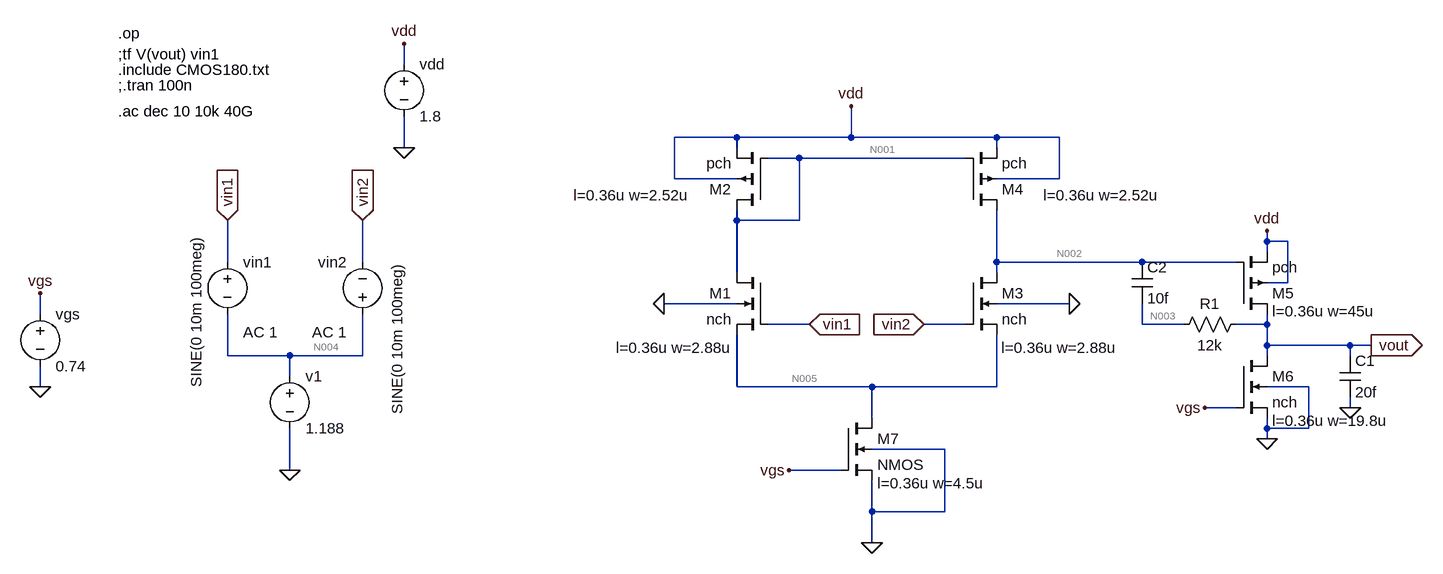
[diagram p0: schematic two STAGE OPAMP new - Copy.asc]
two STAGE OPAMP new - Copy.asc, the LTspice schematic file:
Version 4
SHEET 1 1008 680
WIRE -592 -96 -592 -128
WIRE -80 16 -176 16
WIRE 96 16 96 -32
WIRE 96 16 -80 16
WIRE 320 16 96 16
WIRE 416 16 320 16
WIRE -592 32 -592 -16
WIRE -80 32 -80 16
WIRE 320 32 320 16
WIRE 16 48 -32 48
WIRE 272 48 16 48
WIRE -176 80 -176 16
WIRE -80 80 -176 80
WIRE 416 80 416 16
WIRE 416 80 320 80
WIRE -80 144 -80 128
WIRE 16 144 16 48
WIRE 16 144 -80 144
WIRE 736 176 736 160
WIRE 768 176 736 176
WIRE 736 192 736 176
WIRE -864 208 -864 144
WIRE -656 208 -656 144
WIRE 320 208 320 128
WIRE 544 208 320 208
WIRE 688 208 544 208
WIRE -80 224 -80 144
WIRE 320 224 320 208
WIRE 768 240 768 176
WIRE 768 240 736 240
WIRE -80 272 -192 272
WIRE 432 272 320 272
WIRE -1152 288 -1152 256
WIRE 32 304 -32 304
WIRE 272 304 208 304
WIRE 544 304 544 272
WIRE 608 304 544 304
WIRE 736 304 736 288
WIRE 736 304 688 304
WIRE 736 336 736 304
WIRE 864 336 736 336
WIRE 896 336 864 336
WIRE -864 352 -864 288
WIRE -768 352 -864 352
WIRE -656 352 -656 288
WIRE -656 352 -768 352
WIRE 736 352 736 336
WIRE 864 352 864 336
WIRE -768 384 -768 352
WIRE -1152 400 -1152 368
WIRE -80 400 -80 320
WIRE 128 400 -80 400
WIRE 320 400 320 320
WIRE 320 400 128 400
WIRE 800 400 736 400
WIRE 688 432 640 432
WIRE 864 432 864 416
WIRE 128 448 128 400
WIRE 736 464 736 448
WIRE 800 464 800 400
WIRE 800 464 736 464
WIRE 736 480 736 464
WIRE 240 496 128 496
WIRE -768 528 -768 464
WIRE 80 528 0 528
WIRE 128 592 128 544
WIRE 240 592 240 496
WIRE 240 592 128 592
WIRE 128 640 128 592
FLAG 96 -32 vdd
FLAG -768 528 0
FLAG -864 144 vin1
IOPIN -864 144 In
FLAG -656 144 vin2
IOPIN -656 144 In
FLAG 32 304 vin1
IOPIN 32 304 In
FLAG 208 304 vin2
IOPIN 208 304 In
FLAG -592 -128 vdd
FLAG -592 32 0
FLAG -192 272 0
FLAG 432 272 0
FLAG 736 160 vdd
FLAG 896 336 vout
IOPIN 896 336 Out
FLAG 736 480 0
FLAG 640 432 vgs
FLAG 864 432 0
FLAG -1152 400 0
FLAG -1152 256 vgs
FLAG 128 640 0
FLAG 0 528 vgs
DATAFLAG 320 160 ""
DATAFLAG 320 160 ""
DATAFLAG -80 144 ""
DATAFLAG -80 144 ""
DATAFLAG 128 400 ""
SYMBOL nmos4 -32 224 M0
WINDOW 123 55 116 Left 2
SYMATTR Value2 l=0.36u w=2.88u
SYMATTR InstName M1
SYMATTR Value nch
SYMBOL pmos4 -32 128 R180
WINDOW 123 120 23 Left 2
SYMATTR Value2 l=0.36u w=2.52u
SYMATTR InstName M2
SYMATTR Value pch
SYMBOL nmos4 272 224 R0
WINDOW 123 55 116 Left 2
SYMATTR Value2 l=0.36u w=2.88u
SYMATTR InstName M3
SYMATTR Value nch
SYMBOL pmos4 272 128 M180
WINDOW 123 120 23 Left 2
SYMATTR Value2 l=0.36u w=2.52u
SYMATTR InstName M4
SYMATTR Value pch
SYMBOL voltage -768 368 R0
WINDOW 123 0 0 Left 0
WINDOW 39 0 0 Left 0
SYMATTR InstName v1
SYMATTR Value 1.188
SYMBOL voltage -864 192 R0
WINDOW 3 -48 -25 VRight 2
WINDOW 123 24 124 Left 2
WINDOW 39 0 0 Left 0
SYMATTR Value SINE(0 10m 100meg)
SYMATTR Value2 AC 1
SYMATTR InstName vin1
SYMBOL voltage -656 304 R180
WINDOW 0 24 96 Left 2
WINDOW 3 -53 -138 VRight 2
WINDOW 123 24 -12 Left 2
WINDOW 39 0 0 Left 0
SYMATTR InstName vin2
SYMATTR Value SINE(0 10m 100meg)
SYMATTR Value2 AC 1
SYMBOL voltage -592 -112 R0
WINDOW 123 0 0 Left 0
WINDOW 39 0 0 Left 0
SYMATTR InstName vdd
SYMATTR Value 1.8
SYMBOL pmos4 688 288 M180
WINDOW 123 56 4 Left 2
SYMATTR Value2 l=0.36u w=45u
SYMATTR InstName M5
SYMATTR Value pch
SYMBOL nmos4 688 352 R0
WINDOW 123 56 100 Left 2
SYMATTR Value2 l=0.36u w=19.8u
SYMATTR InstName M6
SYMATTR Value nch
SYMBOL cap 848 352 R0
SYMATTR InstName C1
SYMATTR Value 20f
SYMBOL voltage -1152 272 R0
WINDOW 123 0 0 Left 0
WINDOW 39 0 0 Left 0
SYMATTR InstName vgs
SYMATTR Value 0.74
SYMBOL cap 528 208 R0
SYMATTR InstName C2
SYMATTR Value 10f
SYMBOL res 704 288 R90
WINDOW 0 0 56 VBottom 2
WINDOW 3 32 56 VTop 2
SYMATTR InstName R1
SYMATTR Value 12k
SYMBOL nmos4 80 448 R0
WINDOW 123 56 100 Left 2
SYMATTR Value2 l=0.36u w=4.5u
SYMATTR InstName M7
TEXT -1032 -88 Left 2 !.include CMOS180.txt
TEXT -1032 -144 Left 2 !.op
TEXT -1032 -112 Left 2 !;tf V(vout) vin1
TEXT -1032 -64 Left 2 !;.tran 100n
TEXT -1032 -24 Left 2 !.ac dec 10 10k 40G

The netlist it stands for:
* two STAGE OPAMP new - Copy.asc
M1 N001 vin1 N005 0 nch l=0.36u w=2.88u
M2 N001 N001 vdd vdd pch l=0.36u w=2.52u
M3 N002 vin2 N005 0 nch l=0.36u w=2.88u
M4 N002 N001 vdd vdd pch l=0.36u w=2.52u
v1 N004 0 1.188
vin1 vin1 N004 SINE(0 10m 100meg) AC 1
vin2 N004 vin2 SINE(0 10m 100meg) AC 1
vdd vdd 0 1.8
M5 vout N002 vdd vdd pch l=0.36u w=45u
M6 vout vgs 0 0 nch l=0.36u w=19.8u
C1 vout 0 20f
vgs vgs 0 0.74
C2 N002 N003 10f
R1 vout N003 12k
M7 N005 vgs 0 0 NMOS l=0.36u w=4.5u
.model NMOS NMOS
.model PMOS PMOS
.lib standard.mos
.include CMOS180.txt
.op
;tf V(vout) vin1
;.tran 100n
.ac dec 10 10k 40G
.backanno
.end

* Results of the author's LTspice run, read from the files saved beside the schematic
* Operating Point, zero values left out:
*   V(n001) = 1.01 V
*   V(vin1) = 1.188 V
*   V(n005) = 446.5 mV
*   V(vdd) = 1.8 V
*   V(n002) = 1.01 V
*   V(vin2) = 1.188 V
*   V(n004) = 1.188 V
*   V(vout) = 896.2 mV
*   V(vgs) = 740 mV
*   V(n003) = 896.2 mV
*   Id(M5) = -527.8 µA
*   Is(M5) = 527.8 µA
*   Id(M4) = -28.84 µA
*   Is(M4) = 28.84 µA
*   Id(M2) = -28.84 µA
*   Is(M2) = 28.84 µA
*   Id(M6) = 527.8 µA
*   Is(M6) = -527.8 µA
*   Id(M3) = 28.84 µA
*   Ib(M3) = -1.476 pA
*   Is(M3) = -28.84 µA
*   Id(M1) = 28.84 µA
*   Ib(M1) = -1.476 pA
*   Is(M1) = -28.84 µA
*   Id(M7) = 57.68 µA
*   Is(M7) = -57.68 µA
*   I(Vdd) = -585.5 µA
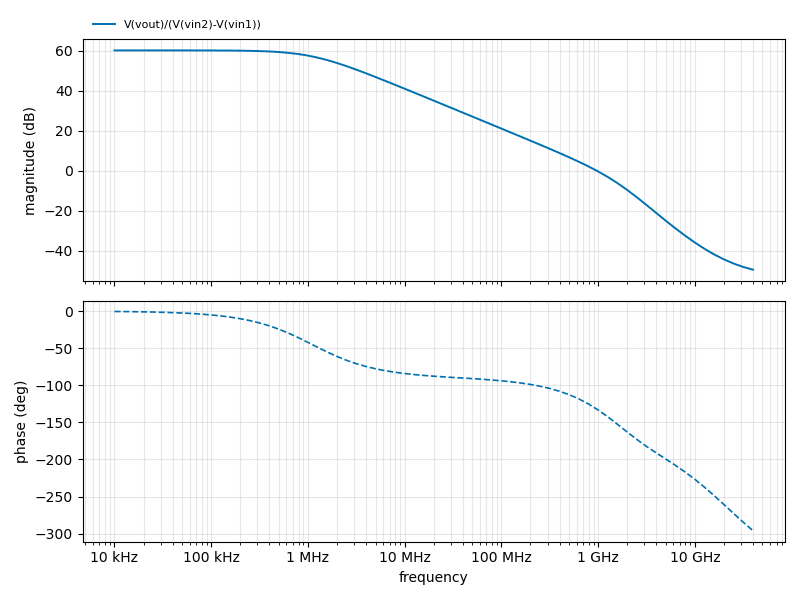
[diagram p1: AC Analysis of two STAGE OPAMP new - Copy.asc, plotted from the saved traces]
* AC Analysis, 1 run:
*   V(vout)/(V(vin2)-V(vin1)): 60.26 dB at 10 kHz, -49.56 dB at 40 GHz, peak 60.26 dB at 10 kHz, 3 dB below the peak at 1.098 MHz
* From the log:
*   Semiconductor Device Operating Points:
*                           --- MOSFET Transistors ---
*   Name:          m7
*   Model:        nmos
*   Id:          5.77e-05
*   Vgs:         7.40e-01
*   Vds:         4.46e-01
*   Vbs:         0.00e+00
*   Vth:         0.00e+00
*   Vdsat:       7.40e-01
*   Gm:          1.12e-04
*   Gds:         7.34e-05
*   Gmb:         0.00e+00
*   Cbd:         0.00e+00
*   Cbs:         0.00e+00
*   Cgsov:       0.00e+00
*   Cgdov:       0.00e+00
*   Cgbov:       0.00e+00
*   Cgs:         0.00e+00
*   Cgd:         0.00e+00
*   Cgb:         0.00e+00
*                           --- BSIM3 MOSFETS ---
*   Name:        m5          m4          m2          m6          m3
*   Model:       pch         pch         pch         nch         nch
*   Id:       -5.28e-04   -2.88e-05   -2.88e-05    5.28e-04    2.88e-05
*   Vgs:      -7.90e-01   -7.90e-01   -7.90e-01    7.40e-01    7.42e-01
*   Vds:      -9.04e-01   -7.90e-01   -7.90e-01    8.96e-01    5.63e-01
*   Vbs:       0.00e+00    0.00e+00    0.00e+00    0.00e+00   -4.46e-01
*   Vth:      -4.49e-01   -4.48e-01   -4.48e-01    4.59e-01    5.82e-01
*   Vdsat:    -2.83e-01   -2.76e-01   -2.76e-01    2.05e-01    1.40e-01
*   Gm:        2.77e-03    1.52e-04    1.52e-04    3.59e-03    3.40e-04
*   Gds:       6.01e-05    3.57e-06    3.57e-06    4.81e-05    4.78e-06
*   Gmb        9.00e-04    4.79e-05    4.79e-05    9.35e-04    7.72e-05
*   Cbd:       0.00e+00    0.00e+00    0.00e+00    0.00e+00    0.00e+00
*   Cbs:       0.00e+00    0.00e+00    0.00e+00    0.00e+00    0.00e+00
*   Cgsov:     2.96e-14    1.66e-15    1.66e-15    9.72e-15    1.41e-15
*   Cgdov:     2.96e-14    1.66e-15    1.66e-15    9.72e-15    1.41e-15
*   Cgbov:     2.98e-19    2.98e-19    2.98e-19    3.28e-19    3.28e-19
*   dQgdVgb:   1.54e-13    8.65e-15    8.65e-15    6.58e-14    9.42e-15
*   dQgdVdb:  -2.96e-14   -1.66e-15   -1.66e-15   -9.47e-15   -1.38e-15
*   dQgdVsb:  -1.20e-13   -6.73e-15   -6.73e-15   -5.33e-14   -7.63e-15
*   dQddVgb:  -2.97e-14   -1.66e-15   -1.66e-15   -9.77e-15   -1.43e-15
*   dQddVdb:   2.96e-14    1.66e-15    1.66e-15    9.75e-15    1.42e-15
*   dQddVsb:   7.54e-17    5.20e-18    5.20e-18    3.47e-17    1.19e-17
*   dQbdVgb:  -1.94e-14   -1.12e-15   -1.12e-15   -9.90e-15   -1.33e-15
*   dQbdVdb:  -1.87e-17   -1.86e-18   -1.86e-18    1.91e-17    1.63e-19
*   dQbdVsb:  -9.39e-15   -4.80e-16   -4.80e-16   -4.12e-15   -3.77e-16
*   Name:        m1
*   Model:       nch
*   Id:        2.88e-05
*   Vgs:       7.42e-01
*   Vds:       5.63e-01
*   Vbs:      -4.46e-01
*   Vth:       5.82e-01
*   Vdsat:     1.40e-01
*   Gm:        3.40e-04
*   Gds:       4.78e-06
*   Gmb        7.72e-05
*   Cbd:       0.00e+00
*   Cbs:       0.00e+00
*   Cgsov:     1.41e-15
*   Cgdov:     1.41e-15
*   Cgbov:     3.28e-19
*   dQgdVgb:   9.42e-15
*   dQgdVdb:  -1.38e-15
*   dQgdVsb:  -7.63e-15
*   dQddVgb:  -1.43e-15
*   dQddVdb:   1.42e-15
*   dQddVsb:   1.19e-17
*   dQbdVgb:  -1.33e-15
*   dQbdVdb:   1.63e-19
*   dQbdVsb:  -3.77e-16